# EAGLE design bebox_buttons (EAGLE 9.2.2)
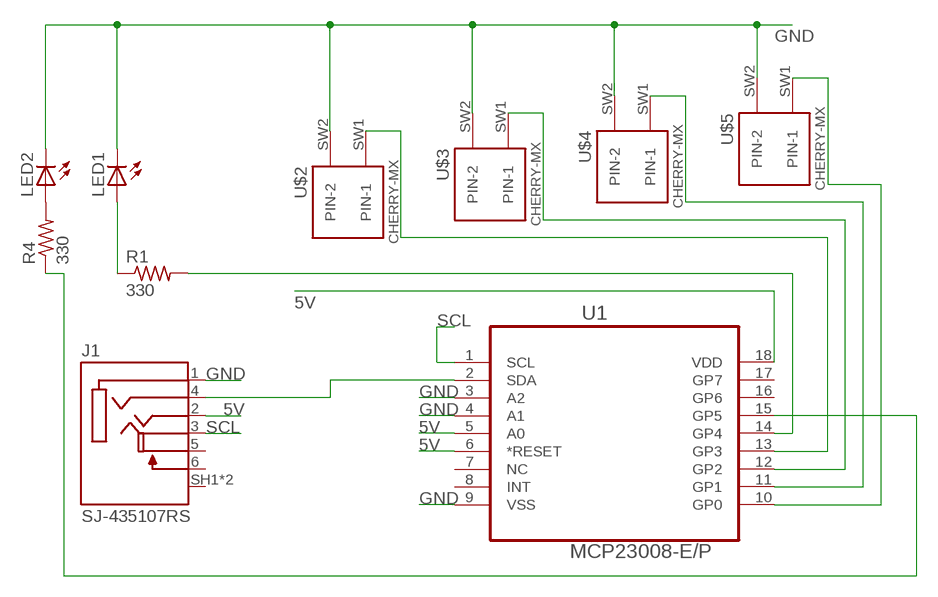
[diagram p0: schematic, sheet 1]

## Parts
J1  SJ-435107RS  [CUI_SJ-435107RS]
LED1  LED5MM  [LED5MM]
LED2  LED5MM  [LED5MM]
R1  330  R-US_0207/10  [0207/10]
R4  330  R-US_0207/10  [0207/10]
U1  MCP23008-E/P  [DIP254P762X533-18]
U$2  CHERRY-MX  [CHERRY-MX]
U$3  CHERRY-MX  [CHERRY-MX]
U$4  CHERRY-MX  [CHERRY-MX]
U$5  CHERRY-MX  [CHERRY-MX]

## Nets
5V: J1.2(TIP) U1.5(A0) U1.6(*RESET) U1.18(VDD)
GND: J1.1(SLEEVE) LED1.K(C) LED2.K(C) U1.3(A2) U1.4(A1) U1.9(VSS) U$2.SW2(PIN-2) U$3.SW2(PIN-2) U$4.SW2(PIN-2) U$5.SW2(PIN-2)
N$1: U1.10(GP0) U$5.SW1(PIN-1)
N$2: U1.11(GP1) U$4.SW1(PIN-1)
N$3: U1.12(GP2) U$3.SW1(PIN-1)
N$4: U1.13(GP3) U$2.SW1(PIN-1)
N$6: LED1.A R1.1
N$7: R1.2 U1.14(GP4)
N$8: LED2.A R4.2
N$9: J1.4(RING2) U1.2(SDA)
N$11: R4.1 U1.15(GP5)
SCL: J1.3(RING1) U1.1(SCL)
Unconnected: J1.5(ISOLATED_RING1) J1.6(ISOLATED_RING1_SWITCH(N-O)) J1.SH1(SHIELD) J1.SH2(SHIELD) U1.7(NC) U1.8(INT) U1.16(GP6) U1.17(GP7)

## Library data of the parts
J1 = SJ-435107RS:SJ-435107RS: 3.5 mm Right Angle Shielded (0.141", 1/8", Mini Plug) Female HeadPhone Jack; AVAILABILITY: Good; DESCRIPTION: 3.5 mm Right Angle Shielded _0.141, 1/8, Mini Plug_ Female HeadPhone Jack; MF: CUI; MP: SJ-435107RS; PACKAGE: None; PRICE: 1.04 USD
LED1 LED2 = led:LED: LED OSRAM: - CHIPLED LG R971, LG N971, LY N971, LG Q971, LY Q971, LO R971, LY R971 LH N974, LH R974 LS Q976, LO Q976, LY Q976 LO Q996 - Hyper CHIPLED LW Q18S LB Q993, LB Q99A, LB R99A - SideLED LS A670, LO A670, LY A670, LG A670, LP A670 LB A673, LV A673, LT A673, LW A673 LH A674 LY A675 LS A676, LA A676, LO A676, LY A676, LW A676 LS A679, LY A679, LG A679 - Hyper Micro SIDELED® LS Y876, LA Y876, LO Y876, LY Y876 LT Y87S - SmartLED LW L88C, LW L88S LB L89C, LB L89S, LG L890 LS L89K, LO L89K, LY L89K LS L896, LA L896, LO L896, LY L896 - TOPLED LS T670, LO T670, LY T670, LG T670, LP T670 LSG T670, LSP T670, LSY T670, LOP T670, LYG T670 LG T671, LOG T671, LSG T671 LB T673, LV T673, LT T673, LW T673 LH T674 LS T676, LA T676, LO T676, LY T676, LB T676, LH T676, LSB T676, LW T676 LB T67C, LV T67C, LT T67C, LS T67K, LO T67K, LY T67K, LW E67C LS E67B, LA E67B, LO E67B, LY E67B, LB E67C, LV E67C, LT E67C LW T67C LS T679, LY T679, LG T679 LS T770, LO T770, LY T770, LG T770, LP T770 LB T773, LV T773, LT T773, LW T773 LH T774 LS E675, LA E675, LY E675, LS T675 LS T776, LA T776, LO T776, LY T776, LB T776 LHGB T686 LT T68C, LB T68C - Hyper Mini TOPLED® LB M676 - Mini TOPLED Santana® LG M470 LS M47K, LO M47K, LY M47K Source: http://www.osram.convergy.de LUXEON: - LUMILED® LXK2-PW12-R00, LXK2-PW12-S00, LXK2-PW14-U00, LXK2-PW14-V00 LXK2-PM12-R00, LXK2-PM12-S00, LXK2-PM14-U00 LXK2-PE12-Q00, LXK2-PE12-R00, LXK2-PE12-S00, LXK2-PE14-T00, LXK2-PE14-U00 LXK2-PB12-K00, LXK2-PB12-L00, LXK2-PB12-M00, LXK2-PB14-N00, LXK2-PB14-P00, LXK2-PB14-Q00 LXK2-PR12-L00, LXK2-PR12-M00, LXK2-PR14-Q00, LXK2-PR14-R00 LXK2-PD12-Q00, LXK2-PD12-R00, LXK2-PD12-S00 LXK2-PH12-R00, LXK2-PH12-S00 LXK2-PL12-P00, LXK2-PL12-Q00, LXK2-PL12-R00 Source: www.luxeon.com KINGBRIGHT: KA-3528ASYC Source: www.kingbright.com
R1 R4 = rcl:R-US_: RESISTOR, American symbol; SPICEPREFIX: R
U1 = MCP23008-E_P:MCP23008-E/P: IC I/O EXPANDER I2C 8B; AVAILABILITY: Unavailable; DESCRIPTION: MCP23008 Series 5.5 V 1.7 MHz 8-Bit I/O Expander with Serial Interface - PDIP-18; MF: Microchip; MP: MCP23008-E/P; PACKAGE: PDIP-18 Microchip; PRICE: None
U$2-U$5 = cherrymx:CHERRY-MX: Cherry MX series keyswitch

## Board
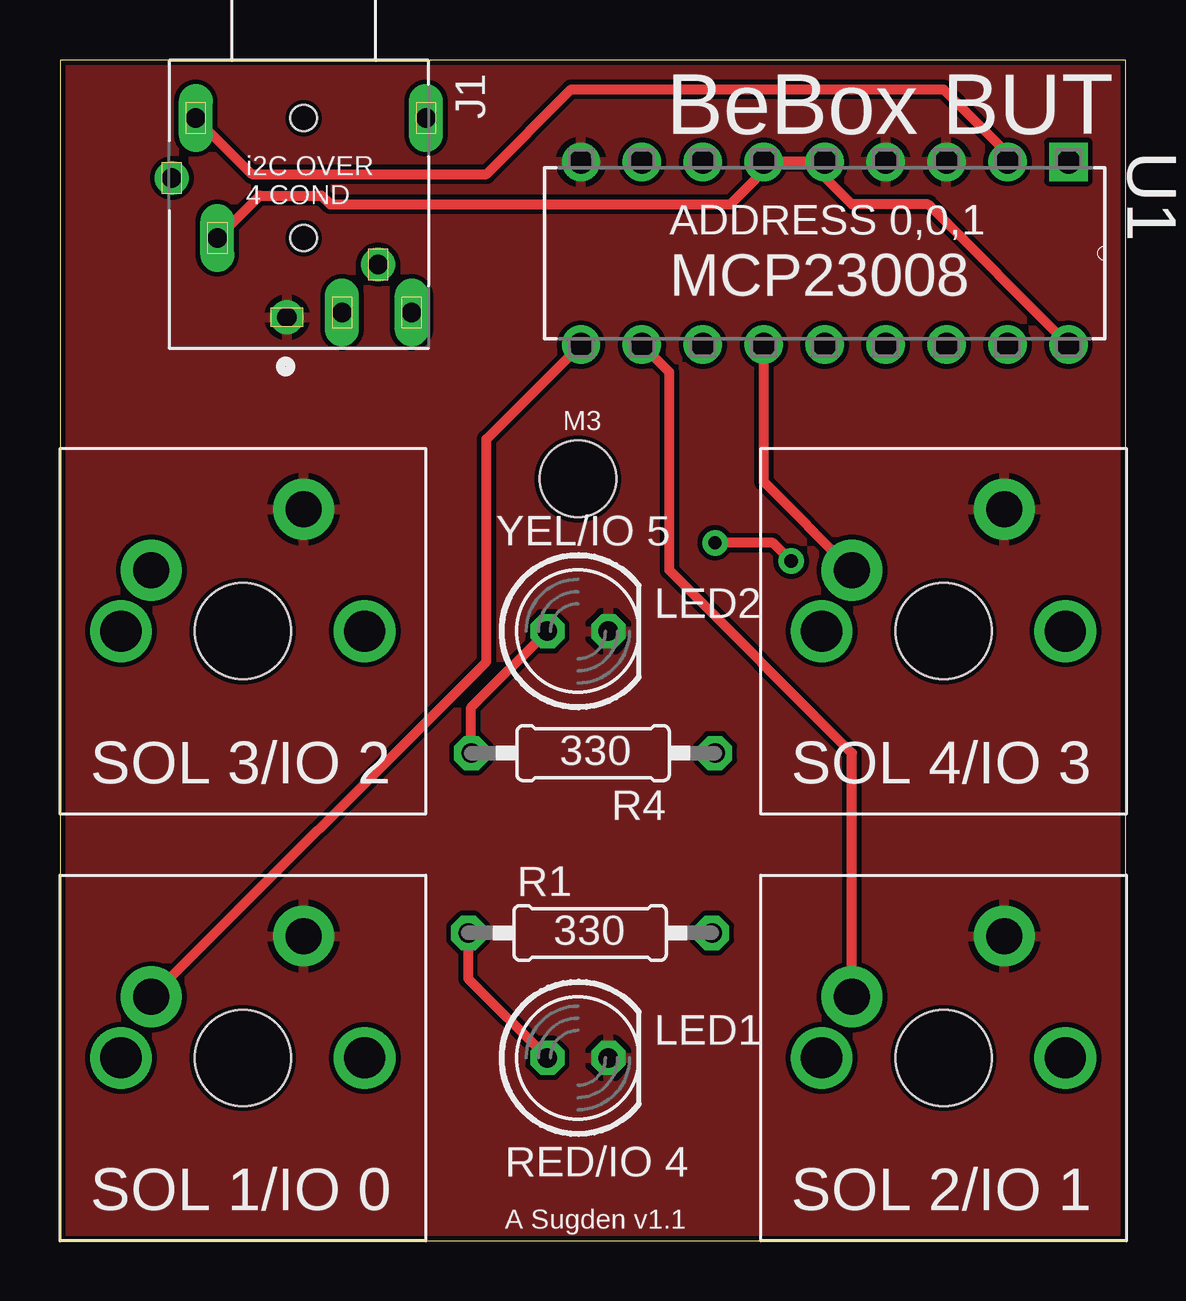
[diagram p1: board, top side]
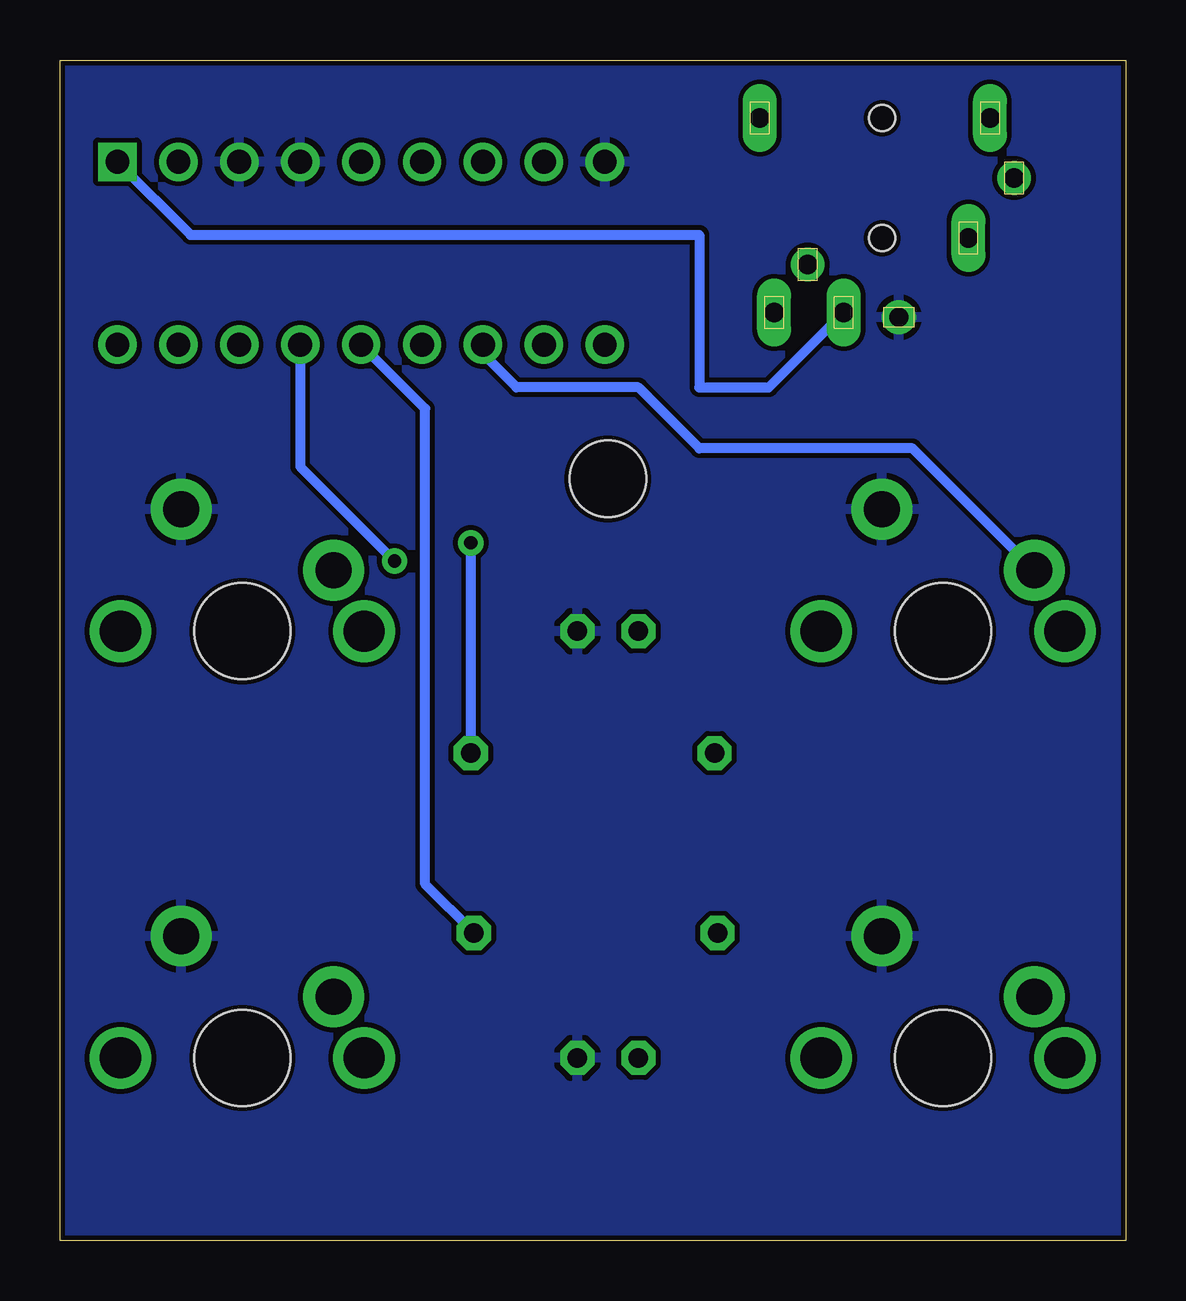
[diagram p2: board, bottom side, seen from below]

Size 44.43 x 49.2 mm. Coordinates in mm from the lower left corner, seen from the top.
Outline: 0,0 44.43,0 44.43,49.2 0,49.2 0,0
Copper layers (1*16): Top 0.035mm / dielectric 1.5mm / Bottom 0.035mm
Design rules "SparkFun": minimum track width 8mil, minimum drill 20mil, track to track 8mil, track to pad 8mil, pad to pad 8mil, via to via 8mil, smd to smd 8mil, copper to edge 8mil, drill to drill 8mil, minimum pad ring 12mil, minimum via ring 10mil, stop-mask expansion 4mil, vias tented up to drill 20mil, thermal gap 10mil
Holes 3.2 mm at 21.59,31.75

### Footprints (pad centres in the part's own frame; a part is rotated, then mirrored left to right if it is on the bottom)
CUI_SJ-435107RS = drill 0.8 pad 1.1: 1 4.7,-0.7; 5 2.5,3.1; SH2 -1.1,-5.5 | drill 0.8 pad 1.1 long: 2 1.4,-3.6; 3 4.5,1.6; 4 -3.6,-4.5; 6 4.5,4.5; SH1 -3.6,5.1 | hole 1.1: -3.6,0; 1.4,0
LED5MM = drill 0.813 octagon: A -1.27,0; K 1.27,0
0207/10 = drill 0.813 octagon: 1 -5.08,0; 2 5.08,0
DIP254P762X533-18 = drill 0.991 square: 1 -7.62,20.32 | drill 0.991: 2 -7.62,17.78; 3 -7.62,15.24; 4 -7.62,12.7; 5 -7.62,10.16; 6 -7.62,7.62; 7 -7.62,5.08; 8 -7.62,2.54; 9 -7.62,0; 10 0,0; 11 0,2.54; 12 0,5.08; 13 0,7.62; 14 0,10.16; 15 0,12.7; 16 0,15.24; 17 0,17.78; 18 0,20.32
CHERRY-MX = drill 1.714 pad 1.93: P$3 -5.08,0; P$4 5.08,0 | drill 1.5 pad 2.54: SW1 -3.81,2.54; SW2 2.54,5.08 | hole 4: 0,0

### Placement (x,y rotation side)
J1  10.16,43.18 270 top
LED1  21.59,7.62 0 top
LED2  21.59,25.4 0 top
R1  22.1,12.83 0 top
R4  22.23,20.32 180 top
U1  21.72,37.34 270 top
U$2  36.83,25.4 0 top
U$3  7.62,25.4 0 top
U$4  36.83,7.62 0 top
U$5  7.62,7.62 0 top

### Tracks (layer width: path | path; a pad name or v marks a point on that pad's centre or on a via)
5V
  Top 0.406: U1.18 36.2,43.18 33.02,43.18 31.88,44.32 U1.5 U1.6 29.34,44.58 27.94,43.18 11.26,43.18 10.89,43.55 8.33,43.55 J1.2
GND
  pour Bottom: 0,49.53 0,0 44.45,0 44.45,49.53
  pour Top: 0,49.53 0,0 44.45,0 44.45,49.53
N$1
  Top 0.406: U$5.SW1 17.78,24.13 17.78,33.4 U1.10
N$2
  Top 0.406: U$4.SW1 33.02,20.32 25.4,27.94 25.4,36.2 U1.11
N$3
  Bottom 0.406: U$3.SW1 8.89,33.02 17.78,33.02 20.32,35.56 25.4,35.56 26.8,36.96 U1.12
N$4
  Top 0.406: U$2.SW1 29.34,31.62 U1.13
N$6
  Top 0.406: R1.1 17.02,10.92 LED1.A
N$7
  Bottom 0.406: R1.2 29.21,14.86 29.21,34.67 U1.14
N$8
  Top 0.406: R4.2 17.14,22.23 LED2.A
N$9
  Top 0.406: J1.4 7.99,44.45 17.78,44.45 21.31,47.98 36.83,47.98 39.5,45.31 U1.2
N$11  (via drill 0.55)
  Top 0.406: v30.48,28.32 29.72,29.08 v27.3,29.08
  Bottom 0.406: U1.15 34.42,32.26 v30.48,28.32 | R4.1 v27.3,29.08
SCL
  Bottom 0.406: U1.1 38.99,41.91 17.78,41.91 17.78,35.56 14.88,35.56 J1.3

### Text on the board
tPlace: BeBox BUT | i2C OVER / 4 COND | ADDRESS 0,0,1 | MCP23008 | M3 | YEL/IO 5 | 330 | SOL 3/IO 2 | SOL 4/IO 3 | 330 | RED/IO 4 | SOL 1/IO 0 | A Sugden v1.1 | SOL 2/IO 1